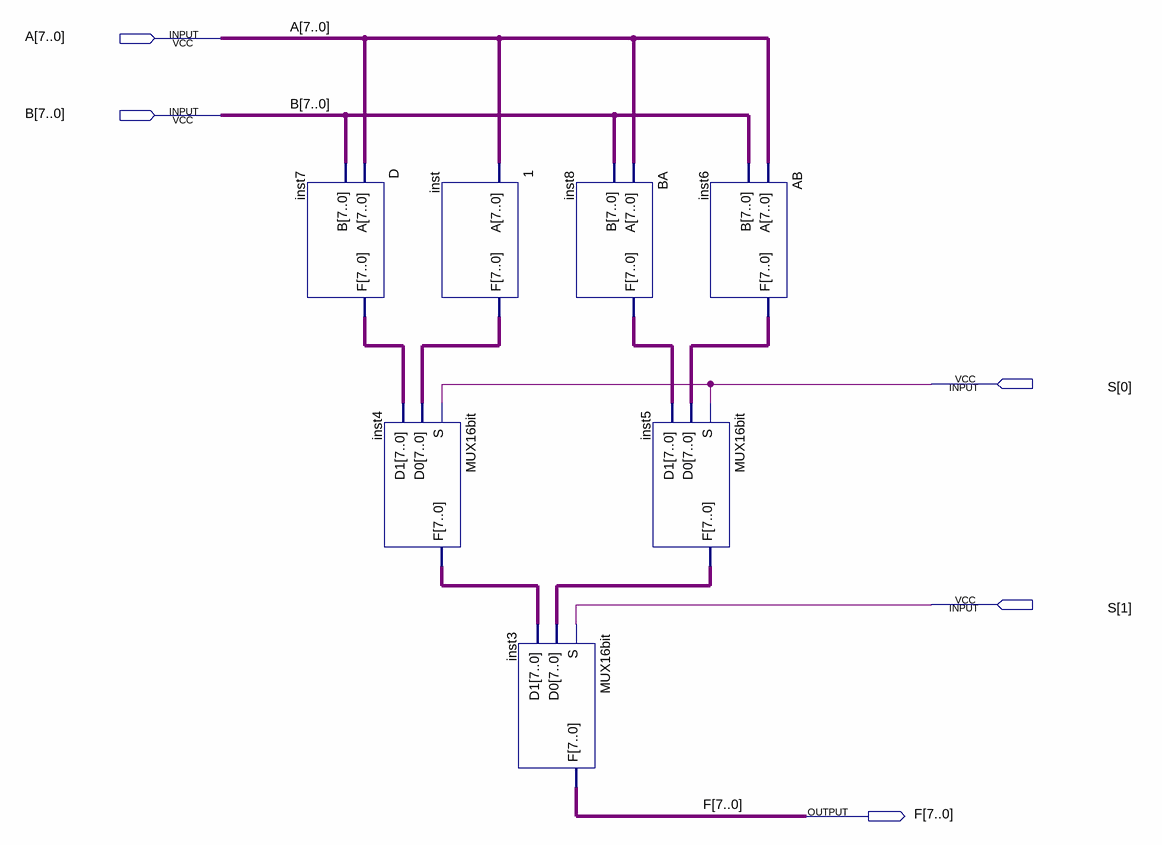
[diagram p0: schematic sheet]
// Quartus schematic ALU.bdf as structural Verilog: 7 symbols, 5 pins
module ALU (
  input  [7:0] A,
  input  [7:0] B,
  input  [1:0] S,
  output [7:0] F
);

  wire [7:0] inst4_f, inst5_f, inst6_f, inst7_f, inst8_f, inst_f;

  D inst7 (.A(A), .B(B), .F(inst7_f));
  \1  inst (.A(A), .F(inst_f));
  MUX16bit inst4 (.S(S[0]), .D0(inst_f), .D1(inst7_f), .F(inst4_f));
  MUX16bit inst3 (.S(S[1]), .D0(inst5_f), .D1(inst4_f), .F(F));
  BA inst8 (.A(A), .B(B), .F(inst8_f));
  MUX16bit inst5 (.S(S[0]), .D0(inst6_f), .D1(inst8_f), .F(inst5_f));
  AB inst6 (.A(A), .B(B), .F(inst6_f));
endmodule
